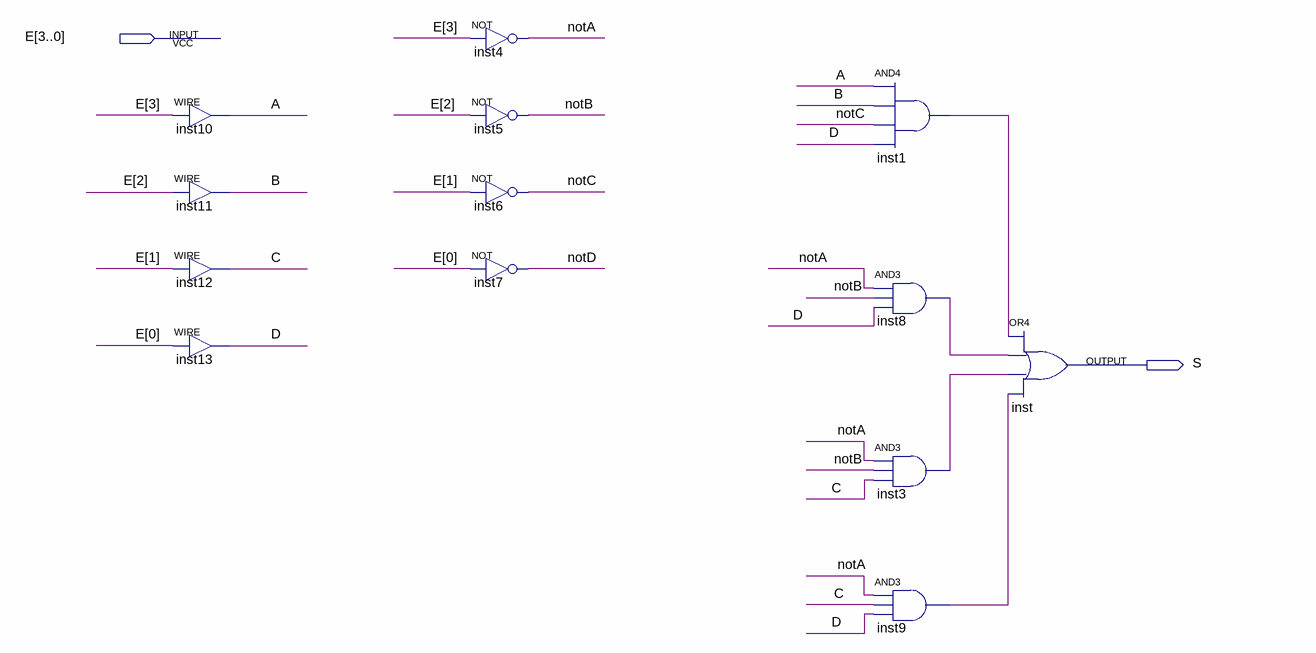
[diagram p0: schematic sheet]
// Quartus schematic segF.bdf as structural Verilog: 13 symbols, 2 pins
module segF (
  input  [3:0] E,
  output S
);

  wire A, B, C, D, inst1_out, inst3_out, inst8_out, inst9_out, notA, notB, notC, notD;

  assign A = E[3];  // WIRE inst10
  assign B = E[2];  // WIRE inst11
  assign C = E[1];  // WIRE inst12
  assign D = E[0];  // WIRE inst13
  not inst4 (notA, E[3]);
  not inst5 (notB, E[2]);
  not inst6 (notC, E[1]);
  not inst7 (notD, E[0]);
  and inst1 (inst1_out, A, B, notC, D);
  and inst8 (inst8_out, notA, notB, D);
  and inst3 (inst3_out, notA, notB, C);
  and inst9 (inst9_out, notA, C, D);
  or inst (S, inst1_out, inst8_out, inst3_out, inst9_out);
endmodule
